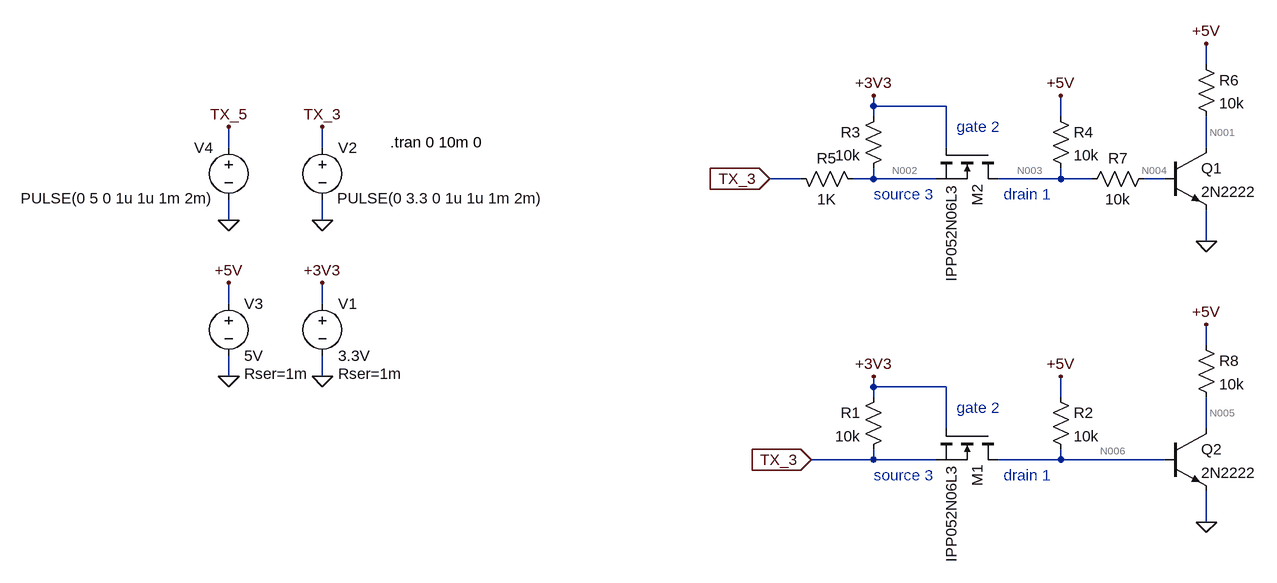
[diagram p0: schematic digilogger.asc]
digilogger.asc, the LTspice schematic file:
Version 4
SHEET 1 1936 680
WIRE 1296 -384 1296 -416
WIRE 784 -320 784 -336
WIRE 896 -320 784 -320
WIRE 784 -304 784 -320
WIRE 1072 -304 1072 -336
WIRE -208 -256 -208 -288
WIRE -64 -256 -64 -288
WIRE 896 -256 896 -320
WIRE 1296 -256 1296 -304
WIRE 672 -208 624 -208
WIRE 784 -208 784 -224
WIRE 784 -208 752 -208
WIRE 880 -208 784 -208
WIRE 1072 -208 1072 -224
WIRE 1072 -208 976 -208
WIRE 1120 -208 1072 -208
WIRE 1232 -208 1200 -208
WIRE -208 -144 -208 -176
WIRE -64 -144 -64 -176
WIRE 1296 -112 1296 -160
WIRE -208 -16 -208 -48
WIRE -64 -16 -64 -48
WIRE 1296 48 1296 16
WIRE -208 96 -208 64
WIRE -64 96 -64 64
WIRE 784 112 784 96
WIRE 896 112 784 112
WIRE 784 128 784 112
WIRE 1072 128 1072 96
WIRE 896 176 896 112
WIRE 1296 176 1296 128
WIRE 784 224 784 208
WIRE 784 224 688 224
WIRE 880 224 784 224
WIRE 1072 224 1072 208
WIRE 1072 224 976 224
WIRE 1232 224 1072 224
WIRE 1296 320 1296 272
FLAG -64 96 0
FLAG -64 -48 +3V3
FLAG -64 -144 0
FLAG -64 -288 TX_3
FLAG -208 96 0
FLAG -208 -48 +5V
FLAG -208 -144 0
FLAG -208 -288 TX_5
FLAG 784 -336 +3V3
FLAG 1072 -336 +5V
FLAG 624 -208 TX_3
IOPIN 624 -208 In
FLAG 1296 -416 +5V
FLAG 1296 -112 0
FLAG 784 96 +3V3
FLAG 1072 96 +5V
FLAG 688 224 TX_3
IOPIN 688 224 In
FLAG 1296 16 +5V
FLAG 1296 320 0
SYMBOL voltage -64 -32 R0
WINDOW 123 0 0 Left 2
WINDOW 39 24 124 Left 2
SYMATTR SpiceLine Rser=1m
SYMATTR InstName V1
SYMATTR Value 3.3V
SYMBOL voltage -64 -272 R0
WINDOW 123 0 0 Left 2
WINDOW 39 0 0 Left 2
WINDOW 3 23 94 Left 2
SYMATTR Value PULSE(0 3.3 0 1u 1u 1m 2m)
SYMATTR InstName V2
SYMBOL voltage -208 -32 R0
WINDOW 123 0 0 Left 2
WINDOW 39 24 124 Left 2
SYMATTR SpiceLine Rser=1m
SYMATTR InstName V3
SYMATTR Value 5V
SYMBOL voltage -208 -272 M0
WINDOW 123 0 0 Left 2
WINDOW 39 0 0 Left 2
WINDOW 3 23 94 Left 2
SYMATTR Value PULSE(0 5 0 1u 1u 1m 2m)
SYMATTR InstName V4
SYMBOL res 800 -320 M0
SYMATTR InstName R3
SYMATTR Value 10k
SYMATTR SpiceLine tol=5 pwr=0.25
SYMBOL nmos 976 -256 R90
SYMATTR InstName M2
SYMATTR Value IPP052N06L3
SYMBOL res 1056 -320 R0
SYMATTR InstName R4
SYMATTR Value 10k
SYMATTR SpiceLine tol=5 pwr=0.25
SYMBOL res 656 -224 M90
WINDOW 0 0 56 VBottom 2
WINDOW 3 32 56 VTop 2
SYMATTR InstName R5
SYMATTR Value 1K
SYMATTR SpiceLine tol=5 pwr=0.25
SYMBOL npn 1232 -256 R0
SYMATTR InstName Q1
SYMATTR Value 2N2222
SYMBOL res 1280 -400 R0
SYMATTR InstName R6
SYMATTR Value 10k
SYMATTR SpiceLine tol=5 pwr=0.25
SYMBOL res 800 112 M0
SYMATTR InstName R1
SYMATTR Value 10k
SYMATTR SpiceLine tol=5 pwr=0.25
SYMBOL nmos 976 176 R90
SYMATTR InstName M1
SYMATTR Value IPP052N06L3
SYMBOL res 1056 112 R0
SYMATTR InstName R2
SYMATTR Value 10k
SYMATTR SpiceLine tol=5 pwr=0.25
SYMBOL npn 1232 176 R0
SYMATTR InstName Q2
SYMATTR Value 2N2222
SYMBOL res 1280 32 R0
SYMATTR InstName R8
SYMATTR Value 10k
SYMATTR SpiceLine tol=5 pwr=0.25
SYMBOL res 1216 -224 R90
WINDOW 0 0 56 VBottom 2
WINDOW 3 32 56 VTop 2
SYMATTR InstName R7
SYMATTR Value 10k
SYMATTR SpiceLine tol=5 pwr=0.25
TEXT 40 -264 Left 2 !.tran 0 10m 0
TEXT 784 -184 Left 2 ;source 3
TEXT 984 -184 Left 2 ;drain 1
TEXT 912 -288 Left 2 ;gate 2
TEXT 784 248 Left 2 ;source 3
TEXT 984 248 Left 2 ;drain 1
TEXT 912 144 Left 2 ;gate 2

The netlist it stands for:
* digilogger.asc
V1 +3V3 0 3.3V Rser=1m
V2 TX_3 0 PULSE(0 3.3 0 1u 1u 1m 2m)
V3 +5V 0 5V Rser=1m
V4 TX_5 0 PULSE(0 5 0 1u 1u 1m 2m)
R3 +3V3 N002 10k tol=5 pwr=0.25
M2 N003 +3V3 N002 N002 IPP052N06L3
R4 +5V N003 10k tol=5 pwr=0.25
R5 TX_3 N002 1K tol=5 pwr=0.25
Q1 N001 N004 0 0 2N2222
R6 +5V N001 10k tol=5 pwr=0.25
R1 +3V3 TX_3 10k tol=5 pwr=0.25
M1 N006 +3V3 TX_3 TX_3 IPP052N06L3
R2 +5V N006 10k tol=5 pwr=0.25
Q2 N005 N006 0 0 2N2222
R8 +5V N005 10k tol=5 pwr=0.25
R7 N004 N003 10k tol=5 pwr=0.25
.model NPN NPN
.model PNP PNP
.lib standard.bjt
.model NMOS NMOS
.model PMOS PMOS
.lib standard.mos
.tran 0 10m 0
* source 3
* drain 1
* gate 2
* source 3
* drain 1
* gate 2
.backanno
.end

* Results of the author's LTspice run, read from the files saved beside the schematic
* Operating Point, zero values left out:
*   V(+3v3) = 3.3 V
*   V(+5v) = 5 V
*   V(n002) = 687.5 mV
*   V(n003) = 687.5 mV
*   V(n001) = 109.1 mV
*   V(n004) = 637.5 mV
*   V(n006) = 4.626 µV
*   V(n005) = 5 V
*   Ic(Q2) = 5.012 pA
*   Ib(Q2) = -5.003 pA
*   Ic(Q1) = 489.1 µA
*   Ib(Q1) = 5.005 µA
*   Ie(Q1) = -494.1 µA
*   Id(M1) = 500 µA
*   Is(M1) = -500 µA
*   Id(M2) = 426.2 µA
*   Is(M2) = -426.2 µA
*   I(R7) = -5.005 µA
*   I(R8) = 5.014 pA
*   I(R2) = 500 µA
*   I(R1) = 330 µA
*   I(R6) = 489.1 µA
*   I(R5) = -687.5 µA
*   I(R4) = 431.2 µA
*   I(R3) = 261.3 µA
*   I(V3) = -1.42 mA
*   I(V2) = 1.517 mA
*   I(V1) = -591.3 µA
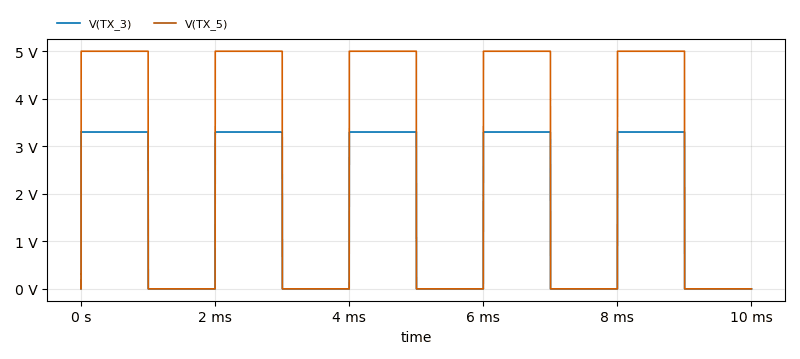
[diagram p1: Transient Analysis of digilogger.asc, plotted from the saved traces]
* Transient Analysis, 1 run:
*   V(TX_3): min 0 V, max 3.3 V, average 1.652 V, rms 2.334 V, last 0 V
*   V(TX_5): min 0 V, max 5 V, average 2.502 V, rms 3.537 V, last 0 V